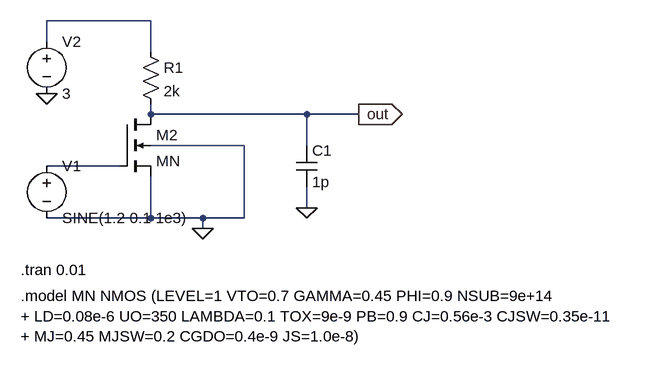
[diagram p0: schematic ex02_CS.asc]
ex02_CS.asc, the LTspice schematic file:
Version 4
SHEET 1 2656 680
WIRE 400 16 240 16
WIRE 240 48 240 16
WIRE 400 64 400 16
WIRE 400 160 400 144
WIRE 640 160 400 160
WIRE 720 160 640 160
WIRE 544 208 400 208
WIRE 640 208 640 160
WIRE 352 240 240 240
WIRE 640 304 640 272
WIRE 400 320 400 256
WIRE 400 320 240 320
WIRE 480 320 400 320
WIRE 544 320 544 208
WIRE 544 320 480 320
WIRE 480 336 480 320
FLAG 480 336 0
FLAG 240 128 0
FLAG 640 304 0
FLAG 720 160 out
IOPIN 720 160 Out
SYMBOL nmos4 352 160 R0
SYMATTR InstName M2
SYMATTR Value MN
SYMATTR Value2 l=1u w=20u m=2
SYMBOL voltage 240 224 R0
WINDOW 123 0 0 Left 0
WINDOW 39 0 0 Left 0
SYMATTR InstName V1
SYMATTR Value SINE(1.2 0.1 1e3)
SYMBOL res 384 48 R0
SYMATTR InstName R1
SYMATTR Value 2k
SYMBOL voltage 240 32 R0
WINDOW 123 0 0 Left 0
WINDOW 39 0 0 Left 0
SYMATTR InstName V2
SYMATTR Value 3
SYMBOL cap 624 208 R0
SYMATTR InstName C1
SYMATTR Value 1p
TEXT 200 440 Left 2 !.model MN NMOS (LEVEL=1 VTO=0.7 GAMMA=0.45 PHI=0.9 NSUB=9e+14 \n+ LD=0.08e-6 UO=350 LAMBDA=0.1 TOX=9e-9 PB=0.9 CJ=0.56e-3 CJSW=0.35e-11 \n+ MJ=0.45 MJSW=0.2 CGDO=0.4e-9 JS=1.0e-8)
TEXT 200 400 Left 2 !.tran 0.01

The netlist it stands for:
* ex02_CS.asc
M2 out N002 0 0 MN l=1u w=20u m=2
V1 N002 0 SINE(1.2 0.1 1e3)
R1 N001 out 2k
V2 N001 0 3
C1 out 0 1p
.model NMOS NMOS
.model PMOS PMOS
.lib standard.mos
.model MN NMOS (LEVEL=1 VTO=0.7 GAMMA=0.45 PHI=0.9 NSUB=9e+14
+ LD=0.08e-6 UO=350 LAMBDA=0.1 TOX=9e-9 PB=0.9 CJ=0.56e-3 CJSW=0.35e-11
+ MJ=0.45 MJSW=0.2 CGDO=0.4e-9 JS=1.0e-8)
.tran 0.01
.backanno
.end